# Altium schematic sheet USBhub.SchDoc
size B; SheetNumber: 1; SheetTotal: 1
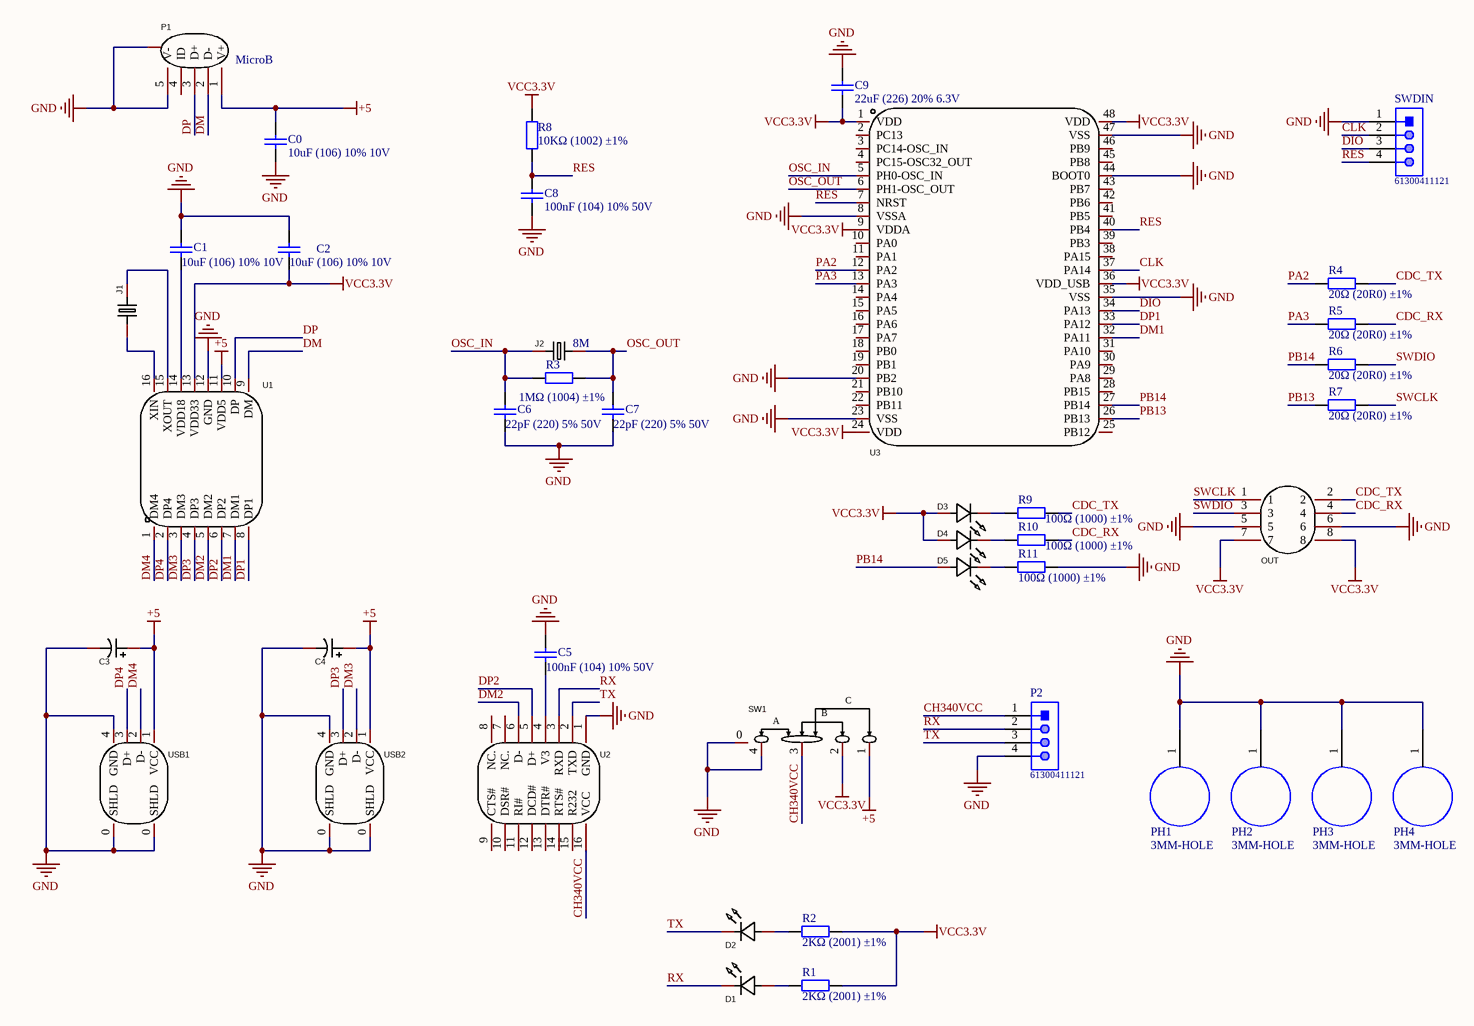
[diagram p0: USBhub.SchDoc]

## Parts
C0  10uF (106) 10% 10V  [0603_C]
C1  10uF (106) 10% 10V  [0603_C]
C2  10uF (106) 10% 10V  [0603_C]
C3  ULR107M1CE08TUX0CR  [CAP-TH_BD6.3-P2.50-D0.6-FD]  (value not drawn)
C4  ULR107M1CE08TUX0CR  [CAP-TH_BD6.3-P2.50-D0.6-FD]  (value not drawn)
C5  100nF (104) 10% 50V  [0603_C]
C6  22pF (220) 5% 50V  [0603_C]
C7  22pF (220) 5% 50V  [0603_C]
C8  100nF (104) 10% 50V  [0603_C]
C9  22uF (226) 20% 6.3V  [0603_C]
D1  RF-BGB170TS-CB-E0  [LED0805-RD_BLUE]  (value not drawn)
D2  RF-BGB170TS-CB-E0  [LED0805-RD_BLUE]  (value not drawn)
D3  RF-BGB170TS-CB-E0  [LED0805-RD_BLUE]  (value not drawn)
D4  RF-BGB170TS-CB-E0  [LED0805-RD_BLUE]  (value not drawn)
D5  RF-BGB170TS-CB-E0  [LED0805-RD_BLUE]  (value not drawn)
J1  XIHCELNANF-12MHZ  [HC-49US_L11.5-W4.5-P4.88]  (value not drawn)
J2  8M  [HC-49US_L11.5-W4.5-P4.88]
OUT  A2541WV-2x4P  [HDR-TH_8P-P2.54-V-R2-C4-S2.54_A2541WV-2X4P]  (value not drawn)
P1  MicroB  [MICRO-USB-SMD_5P-P0.65-H-F_C10418]
P2  61300411121  [61300411121]
PH1  3MM-HOLE  [定位孔]
PH2  3MM-HOLE  [定位孔]
PH3  3MM-HOLE  [定位孔]
PH4  3MM-HOLE  [定位孔]
R1  2KΩ (2001) ±1%  [0805_R]
R2  2KΩ (2001) ±1%  [0805_R]
R3  1MΩ (1004) ±1%  [0805_R]
R4  20Ω (20R0) ±1%  [0805_R]
R5  20Ω (20R0) ±1%  [0805_R]
R6  20Ω (20R0) ±1%  [0805_R]
R7  20Ω (20R0) ±1%  [0805_R]
R8  10KΩ (1002) ±1%  [0805_R]
R9  100Ω (1000) ±1%  [0805_R]
R10  100Ω (1000) ±1%  [0805_R]
R11  100Ω (1000) ±1%  [0805_R]
SW1  TA-3506A-A1  [SW-SMD_4P-L12.7-W2.9-P2.00]  (value not drawn)
SWDIN  61300411121  [61300411121]
U1  SL2.1A  [SOP-16_L10.0-W3.9-P1.27-LS6.0-BL]  (value not drawn)
U2  CH340C  [SOP-16_L10.0-W3.9-P1.27-LS6.0-BL]  (value not drawn)
U3  STM32L052C8T6  [LQFP-48_L7.0-W7.0-P0.50-LS9.0-BL]  (value not drawn)
USB1  916-352A1014Y10210  [USB-A-TH_USB-A-F-1]  (value not drawn)
USB2  916-352A1014Y10210  [USB-A-TH_USB-A-F-1]  (value not drawn)

## Nets
+5: C0.2 C3.1 C4.1 P1.1(V+) SW1.1 U1.11(VDD5) USB1.1(VCC) USB2.1(VCC)
GND: C0.1 C1.2 C2.2 C3.2 C4.2 C5.2 C6.1 C7.1 C8.1 C9.2 OUT.5 OUT.6 P1.0(MTN) P1.5(V-) P2.4 PH1.1 PH2.1 PH3.1 PH4.1 R11.2 SW1.0 SW1.4 SWDIN.1 U1.12(GND) U2.1(GND) U3.8(VSSA) U3.20(PB2) U3.23(VSS) U3.35(VSS) U3.44(BOOT0) U3.47(VSS) USB1.0(SHLD) USB1.4(GND) USB2.0(SHLD) USB2.4(GND)
VCC3.3V: C2.1 C9.1 D3.2(A) D4.2(A) OUT.7 OUT.8 R1.2 R2.2 R8.2 SW1.2 U1.13(VDD33) U3.1(VDD) U3.9(VDDA) U3.24(VDD) U3.36(VDD_USB) U3.48(VDD)
CDC_RX: OUT.4 R5.2 R10.2
CDC_TX: OUT.2 R4.2 R9.2
CH340VCC: P2.1 SW1.3 U2.16(VCC)
CLK: SWDIN.2 U3.37(PA14)
DIO: SWDIN.3 U3.34(PA13)
DM: P1.2(D-) U1.9(DM)
DM1: U1.7(DM1) U3.32(PA11)
DM2: U1.5(DM2) U2.6(D-)
DM3: U1.3(DM3) USB2.2(D-)
DM4: U1.1(DM4) USB1.2(D-)
DP: P1.3(D+) U1.10(DP)
DP1: U1.8(DP1) U3.33(PA12)
DP2: U1.6(DP2) U2.5(D+)
DP3: U1.4(DP3) USB2.3(D+)
DP4: U1.2(DP4) USB1.3(D+)
OSC_IN: C6.2 J2.1 R3.1 U3.5(PH0-OSC_IN)
OSC_OUT: C7.2 J2.2 R3.2 U3.6(PH1-OSC_OUT)
PA2: R4.1 U3.12(PA2)
PA3: R5.1 U3.13(PA3)
PB13: R7.1 U3.26(PB13)
PB14: D5.2(A) R6.1 U3.27(PB14)
RES: C8.2 R8.1 SWDIN.4 U3.7(NRST) U3.40(PB4)
RX: D1.1(K) P2.2 U2.3(RXD)
SWCLK: OUT.1 R7.2
SWDIO: OUT.3 R6.2
TX: D2.1(K) P2.3 U2.2(TXD)
NetC1_1: C1.1 U1.14(VDD18)
NetC5_1: C5.1 U2.4(V3)
NetD1_2: D1.2(A) R1.1
NetD2_2: D2.2(A) R2.1
NetD3_1: D3.1(K) R9.1
NetD4_1: D4.1(K) R10.1
NetD5_1: D5.1(K) R11.1
NetJ1_1: J1.1 U1.16(XIN)
NetJ1_2: J1.2 U1.15(XOUT)

Not connected (* = marked no-connect by the designer): P1 4(ID); U2 7(NC.) 8(NC.) 9(CTS#) 10(DSR#) 11(RI#) 12(DCD#) 13(DTR#) 14(RTS#) 15(R232); U3 2(PC13) 3(PC14-OSC_IN) 4(PC15-OSC32_OUT) 10(PA0) 11(PA1) 14(PA4) 15(PA5) 16(PA6) 17(PA7) 18(PB0) 19(PB1) 21(PB10) 22(PB11) 25(PB12) 28(PB15) 29(PA8) 30(PA9) 31(PA10) 38(PA15) 39(PB3) 41(PB5) 42(PB6) 43(PB7) 45(PB8) 46(PB9)

## Notes on the sheet
- (in symbol TA-3506A-A1) C; B; A

## Library data of the parts
C0-C2 = 0603 10uF (106) 10% 10V: 贴片电容; ComponentLink1Description: 供应商链接; ComponentLink1URL: http://www.szlcsc.com/product/details_20411.html; Package: 0603; Supplier: LC; SuppliersPartNumber: C19702
C3 C4 = 100uF/16V: Manufacturer: MAN YUE(万裕科技); Name: 100uF; Add into BOM: yes; Type: 聚合物; Value: 100uF; Tolerance: ±20%; Rated Voltage: 16V; φD: 6.3mm; L: 8mm; Lifetime @ Temp: 2000hrs@105℃; Symbol: ULR107M1CE08TUX0CR; Device: ULR107M1CE08TUX0CR; LCSC Part Name: 100uF ±20% 16V; Supplier Part: C2923568; Manufacturer Part: ULR107M1CE08TUX0CR; Supplier Footprint: 径向引线,6.3x8mm; JLCPCB Part Class: Extended Part; Datasheet: https://atta.szlcsc.com/upload/public/pdf/source/20211118/585B9CEDE9E08D4A86043C401C7B1F80.pdf; Supplier: LCSC; Convert to PCB: yes; Lead Spacing: 2.5mm; Ripple Current: -; Equivalent Series Resistance(ESR): -; Operating Temperature: -55℃~+105℃
C5 C8 = 0603 100nF (104) 10% 50V: 贴片电容; ComponentLink1Description: 供应商链接; ComponentLink1URL: http://www.szlcsc.com/product/details_15331.html; Package: 0603; Supplier: LC; SuppliersPartNumber: C14663
C6 C7 = 0603 22pF (220) 5% 50V: 贴片电容; ComponentLink1Description: 供应商链接; ComponentLink1URL: http://www.szlcsc.com/product/details_2005.html; Package: 0603; Supplier: LC; SuppliersPartNumber: C1653
C9 = 0603 22uF (226) 20% 6.3V: 贴片电容; ComponentLink1Description: 供应商链接; ComponentLink1URL: http://www.szlcsc.com/product/details_60514.html; Package: 0603; Supplier: LC; SuppliersPartNumber: C59461
D1-D5 = RF-BGB170TS-CB-E0: Manufacturer: Refond(瑞丰); Add into BOM: yes; Emitted Color: 蓝灯; Forward Current: 20mA; Power Dissipation: 70mW; Viewing Angle: 140°; Mounting Sytle: 正贴; Symbol: RF-BGB170TS-CB-E0; Device: RF-BGB170TS-CB-E0; LCSC Part Name: 蓝灯 正贴; Supplier Part: C2908306; Manufacturer Part: RF-BGB170TS-CB-E0; Supplier Footprint: 0805; JLCPCB Part Class: Extended Part; Datasheet: https://atta.szlcsc.com/upload/public/pdf/source/20211101/C871A18E9B6E101B84BDF0C661245F86.pdf; Supplier: LCSC; Convert to PCB: yes; Diode Configuration: -; Lens Color: -; Dominant Wavelength: -; Peak Wavelength: -; Color Temperature: -; Luminous Flux (@25℃): -; Forward Voltage (VF): -; Luminous Intensity: -; Operating Temperature: -40℃~+85℃
J1 = XIHCELNANF-12MHZ: Manufacturer: TAITIEN(泰艺电子); Add into BOM: yes; Name: -; Symbol: XIHCELNANF-12MHZ; Device: XIHCELNANF-12MHZ; LCSC Part Name: 12MHZ 20PF30PPM -40℃~+85℃DIP; Supplier Part: C295072; Manufacturer Part: XIHCELNANF-12MHZ; Supplier Footprint: HC-49S-2P; JLCPCB Part Class: Extended Part; Datasheet: https://atta.szlcsc.com/upload/public/pdf/source/20180928/C295072_40A8829C49447BBE93E34C1F24014779.pdf; Supplier: LCSC; Convert to PCB: yes; Crystal Type: -; Value: -; Frequency Tolerance: -; Load Capacitance: -; Operating Temperature: -
J2 = XIHCELNANF-8MHZ: Manufacturer: TAITIEN(泰艺电子); Add into BOM: yes; Symbol: XIHCELNANF-8MHZ; Device: XIHCELNANF-8MHZ; LCSC Part Name: 8MHZ 20PF30PPM -40℃~+85℃DIP; Supplier Part: C295088; Manufacturer Part: XIHCELNANF-8MHZ; Supplier Footprint: HC-49S; JLCPCB Part Class: Extended Part; Datasheet: https://atta.szlcsc.com/upload/public/pdf/source/20180928/C295088_870B1C8FD6918B666D832F79126576C6.pdf; Supplier: LCSC; Convert to PCB: yes; Crystal Type: -; Value: -; Frequency Tolerance: -; Frequency Stability: -; Load Capacitance: -; Operating Temperature: -
OUT = A2541WV-2x4P: Manufacturer: CJT(长江连接器); Add into BOM: yes; Pitch: 2.54mm; Pin Structure: 2x4P; Circluar Pins/Square Pins: 方针; Symbol: A2541WV-2X4P; Device: A2541WV-2x4P; LCSC Part Name: 2.54mm 2x4P 直插 方针 镀金; Supplier Part: C225519; Manufacturer Part: A2541WV-2x4P; Supplier Footprint: 插件,P=2.54mm; JLCPCB Part Class: Extended Part; Datasheet: https://atta.szlcsc.com/upload/public/pdf/source/20180509/C225519_93746B99266AA550760B05B3359A404E.pdf; Supplier: LCSC; Convert to PCB: yes; Number of Pins: 8; Number of Rows: 2; Row Spacing: 2.54mm; Mounting Type: 直插; Current Rating (Max): -; Voltage Rating (Max): -; Length of Mating Pin: 6mm; Insulation Height: 2.54mm; Length of End Connection Pin: 3mm; Contact Material: 黄铜; Contact Plating: -; Operating Temperature Range: -40℃~+105℃; Color: 黑色
P1 = MicroB: Manufacturer: 精拓金; Symbol: micro USBFemale; Device: 920-E52A2021S10100; Add into BOM: yes; Connector Type: Micro-B; Gender: 母座; Number of Contacts: 5; Number of Ports: 1; Current Rating - Power (Max): 1A; LCSC Part Name: Micro-B 母座; Supplier Part: C10418; Manufacturer Part: 920-E52A2021S10100; Supplier Footprint: SMD; JLCPCB Part Class: Extended Part; Datasheet: https://atta.szlcsc.com/upload/public/pdf/source/20210305/C10418_4890444E73C7CF5EB311058F76E5ECA4.pdf; Supplier: LCSC; Convert to PCB: yes; Standard: USB 2.0
P2 SWDIN = CMP-1502-01064-1: THT Vertical Pin Header WR-PHD, Pitch 2.54 mm, Single Row, 4 pins; Manufacturer: Wurth Elektronik; Withstanding Voltage: 500VAC; Rated Current: 3A; Working Voltage: 250VAC; Pin Number: 4; Gender: Male; Contact Resistance: 20mOhm; Pitch: 2.54mm; Manufacturer URL: http://www.we-online.de; Operating Temperature: -40to105degC; Packaging: Bag; Mounting Technology: THT; Package Reference: 61300411121; Datasheet URL: https://katalog.we-online.de/em/datasheet/6130xx11121.pdf; Publisher: WurthElektronik; Part Number: 61300411121; Row Number: Single; Orientation: Vertical
R1 R2 = 0805 2KΩ (2001) 1%: 贴片电阻; ComponentLink1Description: 供应商链接; ComponentLink1URL: http://www.szlcsc.com/product/details_18292.html; Package: 0805; Supplier: LC; SuppliersPartNumber: C17604
R3 = 0805 1MΩ (1004) 1%: 贴片电阻; ComponentLink1Description: 供应商链接; ComponentLink1URL: http://www.szlcsc.com/product/details_18202.html; Package: 0805; Supplier: LC; SuppliersPartNumber: C17514
R4-R7 = 0805 20Ω (20R0) 1%: 贴片电阻; ComponentLink1Description: 供应商链接; ComponentLink1URL: http://www.szlcsc.com/product/details_18232.html; Package: 0805; Supplier: LC; SuppliersPartNumber: C17544
R8 = 0805 10KΩ (1002) 1%: 贴片电阻; ComponentLink1Description: 供应商链接; ComponentLink1URL: http://www.szlcsc.com/product/details_18102.html; Package: 0805; Supplier: LC; SuppliersPartNumber: C17414
R9-R11 = 0805 100Ω (1000) 1%: 贴片电阻; ComponentLink1Description: 供应商链接; ComponentLink1URL: http://www.szlcsc.com/product/details_18096.html; Package: 0805; Supplier: LC; SuppliersPartNumber: C17408
SW1 = TA-3506A-A1: Manufacturer: Yuandi(台湾元迪); Add into BOM: yes; Name: TA-3506A-A1; Symbol: TA-3506A-A1; Device: TA-3506A-A1; LCSC Part Name: 滑动开关12.7*3*2mm贴片侧拨三档; Supplier Part: C513992; Manufacturer Part: TA-3506A-A1; Supplier Footprint: SMD,12.7x3x2mm; JLCPCB Part Class: Extended Part; Datasheet: https://atta.szlcsc.com/upload/public/pdf/source/20200415/C513992_058D99144D3823D62BE484928641AAFF.pdf; Supplier: LCSC; Convert to PCB: yes
U1 = SL2.1A: Manufacturer: CoreChips(和芯润德); Add into BOM: yes; Name: SL2.1A; Symbol: SL2.1A; Device: SL2.1A; LCSC Part Name: SL2.1A; Supplier Part: C192893; Manufacturer Part: SL2.1A; Supplier Footprint: SOP-16_150mil; JLCPCB Part Class: Extended Part; Datasheet: https://atta.szlcsc.com/upload/public/pdf/source/20180522/C192893_624110D24898D57AAC785E3DF98EA862.pdf; Supplier: LCSC; Convert to PCB: yes; Type: -; Protocol: -; Number of Drivers/Receivers: -; Data Rate: -; Supply Voltage: -
U2 = CH340C: Manufacturer: WCH(南京沁恒); Add into BOM: yes; Protocol: USB 2.0; Data Rate: 2Mbps; Supply Voltage: 3.3V, 5V; Symbol: CH340C; Device: CH340C; LCSC Part Name: CH340C; Supplier Part: C84681; Manufacturer Part: CH340C; Supplier Footprint: SOP-16_150mil; JLCPCB Part Class: Extended Part; Datasheet: https://atta.szlcsc.com/upload/public/pdf/source/20200819/C84681_ADBED554CE321879DBD6B1D06488689C.pdf; Supplier: LCSC; Convert to PCB: yes; Type: Transceiver; Number of Drivers/Receivers: -
U3 = STM32L052C8T6: Manufacturer: ST(意法半导体); Add into BOM: yes; Core Processor: ARM® Cortex®-M0+; Speed: 32MHz; Voltage - Supply (Vcc/Vdd): 1.65V ~ 3.6V; Program Memory Size: 64KB; RAM Size: 8KB; EEPROM Size: 2KB; Number of I/O: 37; A/D: 10x12bit; D/A: 1x12bit; UART/USART: 2 USART; SPI: 4; I2C（SMBUS/PMBUS）: 2; USB Device: 1; Symbol: STM32L052C8T6; Device: STM32L052C8T6; LCSC Part Name: STM32L052C8T6; Supplier Part: C111213; Manufacturer Part: STM32L052C8T6; Supplier Footprint: LQFP-48; JLCPCB Part Class: Extended Part; Datasheet: https://atta.szlcsc.com/upload/public/pdf/source/20171116/C111213_15108220994861123669.pdf; Supplier: LCSC; Convert to PCB: yes; USB Host/OTG: 1
USB1 USB2 = 916-352A1014Y10210: Manufacturer: 精拓金; Symbol: A/F180度插板10铜壳鱼叉脚有卷边白; Add into BOM: yes; Connector Type: Type-A; Gender: 母座; Number of Contacts: 4; Number of Ports: 1; Current Rating - Power (Max): 1.5A; Name: 916-352A1014Y10210; Device: 916-352A1014Y10210; LCSC Part Name: Type-A 母座; Supplier Part: C109358; Manufacturer Part: 916-352A1014Y10210; Supplier Footprint: 插件; JLCPCB Part Class: Extended Part; Datasheet: https://atta.szlcsc.com/upload/public/pdf/source/20210301/C109358_2296360D1A003096FAF60BC9CAB9C237.pdf; Supplier: LCSC; Convert to PCB: yes; Standard: USB 2.0